# EAGLE schematic Orbit I_AnalougeEngine_V1_0 (EAGLE 8.4.1)

## Sheet 1 of 2: Input Section
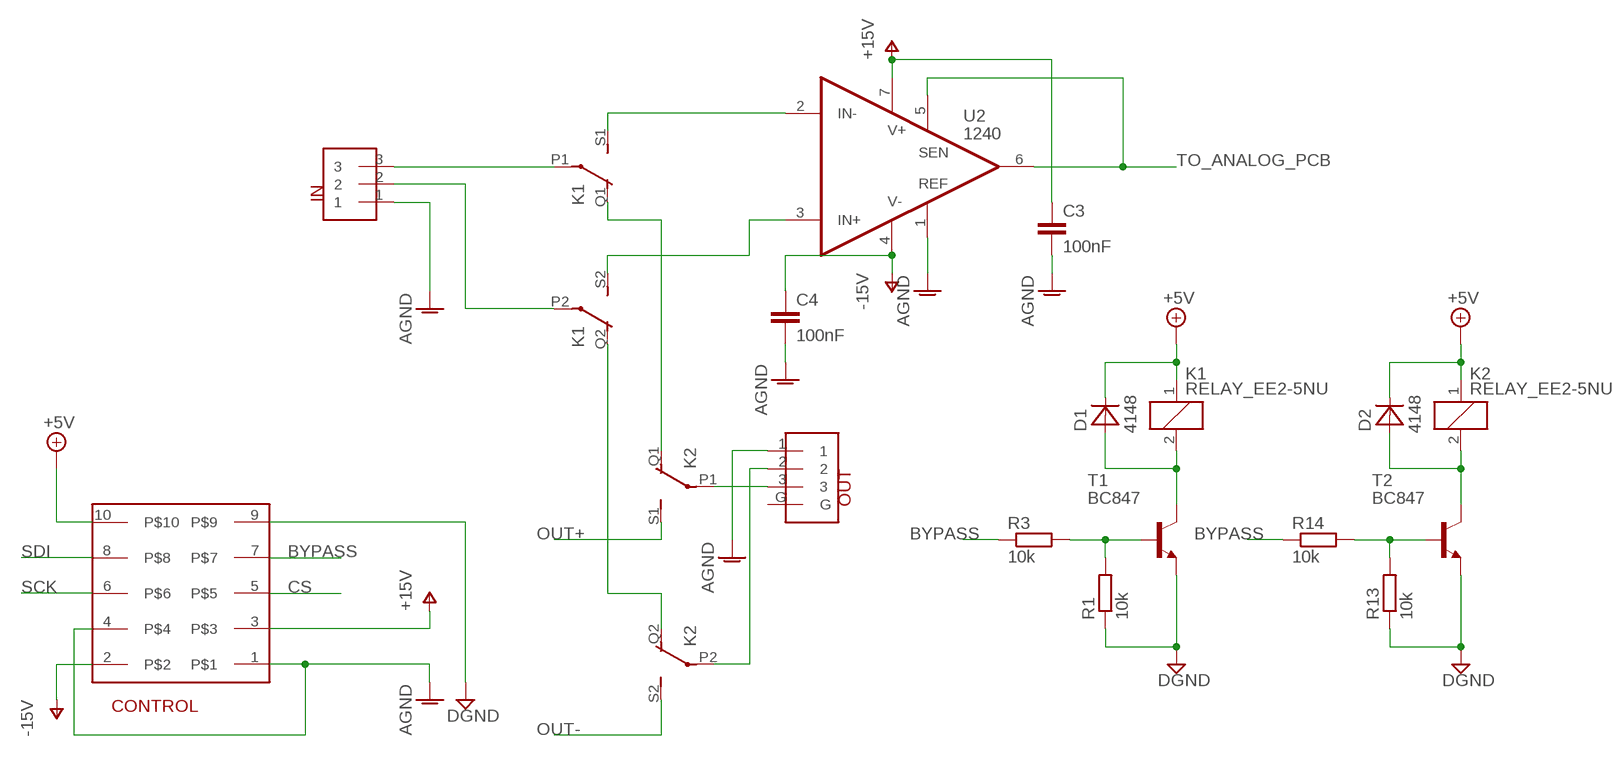
[diagram p0: schematic, sheet 1]

### Parts
C3  100nF  KONDENSATOR_0603  [C0603]
C4  100nF  KONDENSATOR_0603  [C0603]
CONTROL  10PIN_HEADER_SMD  [87832-10]
D1  4148  4148_SOD323  [SOD323-R]
D2  4148  4148_SOD323  [SOD323-R]
IN  NEUTRIK_NC3FAH  [NEUTRIK_NC3FAH]
K1  RELAY_EE2-5NU  [351]
K2  RELAY_EE2-5NU  [351]
OUT  NEUTRIK_NC3MAH  [NEUTRIK_NC3MAH]
R1  10k  WIDERSTAND_0805R0805  [R0805]
R3  10k  WIDERSTAND_0805R0805  [R0805]
R13  10k  WIDERSTAND_0805R0805  [R0805]
R14  10k  WIDERSTAND_0805R0805  [R0805]
T1  BC847  [SOT23]
T2  BC847  [SOT23]
U2  1240  THAT1240SO8-U  [SO08]

### Nets
+5V: CONTROL.10 D1.C D2.C K1.1 K2.1
AGND: C3.2 C4.2 CONTROL.1 CONTROL.4 IN.1 OUT.1 U2.1(REF) ; also sheet 2
BYPASS: CONTROL.7 R3.1 R14.1
CS: CONTROL.5 ; also sheet 2
DGND: CONTROL.9 R1.1 R13.1 T1.2(E) T2.2(E) ; also sheet 2
N$1: K1.S1(2:S) U2.2(IN-)
N$2: K1.S2(3:S) U2.3(IN+)
N$3: D2.A K2.2 T2.3(C)
N$4: R13.2 R14.2 T2.1(B)
N$6: D1.A K1.2 T1.3(C)
N$8: K1.Q1(2:O) K2.Q1(2:O)
N$10: R1.2 R3.2 T1.1(B)
N$11: K1.Q2(3:O) K2.Q2(3:O)
N$21: IN.2 K1.P2(3:P)
N$22: IN.3 K1.P1(2:P)
N$23: K2.P2(3:P) OUT.2
N$24: K2.P1(2:P) OUT.3
OUT+: K2.S1(2:S) ; also sheet 2
OUT-: K2.S2(3:S) ; also sheet 2
SCK: CONTROL.6 ; also sheet 2
SDI: CONTROL.8 ; also sheet 2
TO_ANALOG_PCB: U2.5(SEN) U2.6(OUT) ; also sheet 2
V+: C3.1 CONTROL.3 U2.7(V+) ; supply symbol labelled +15V ; also sheet 2
V-: C4.1 CONTROL.2 U2.4(V-) ; supply symbol labelled -15V ; also sheet 2
Unconnected: OUT.G

## Sheet 2 of 2: Output Section
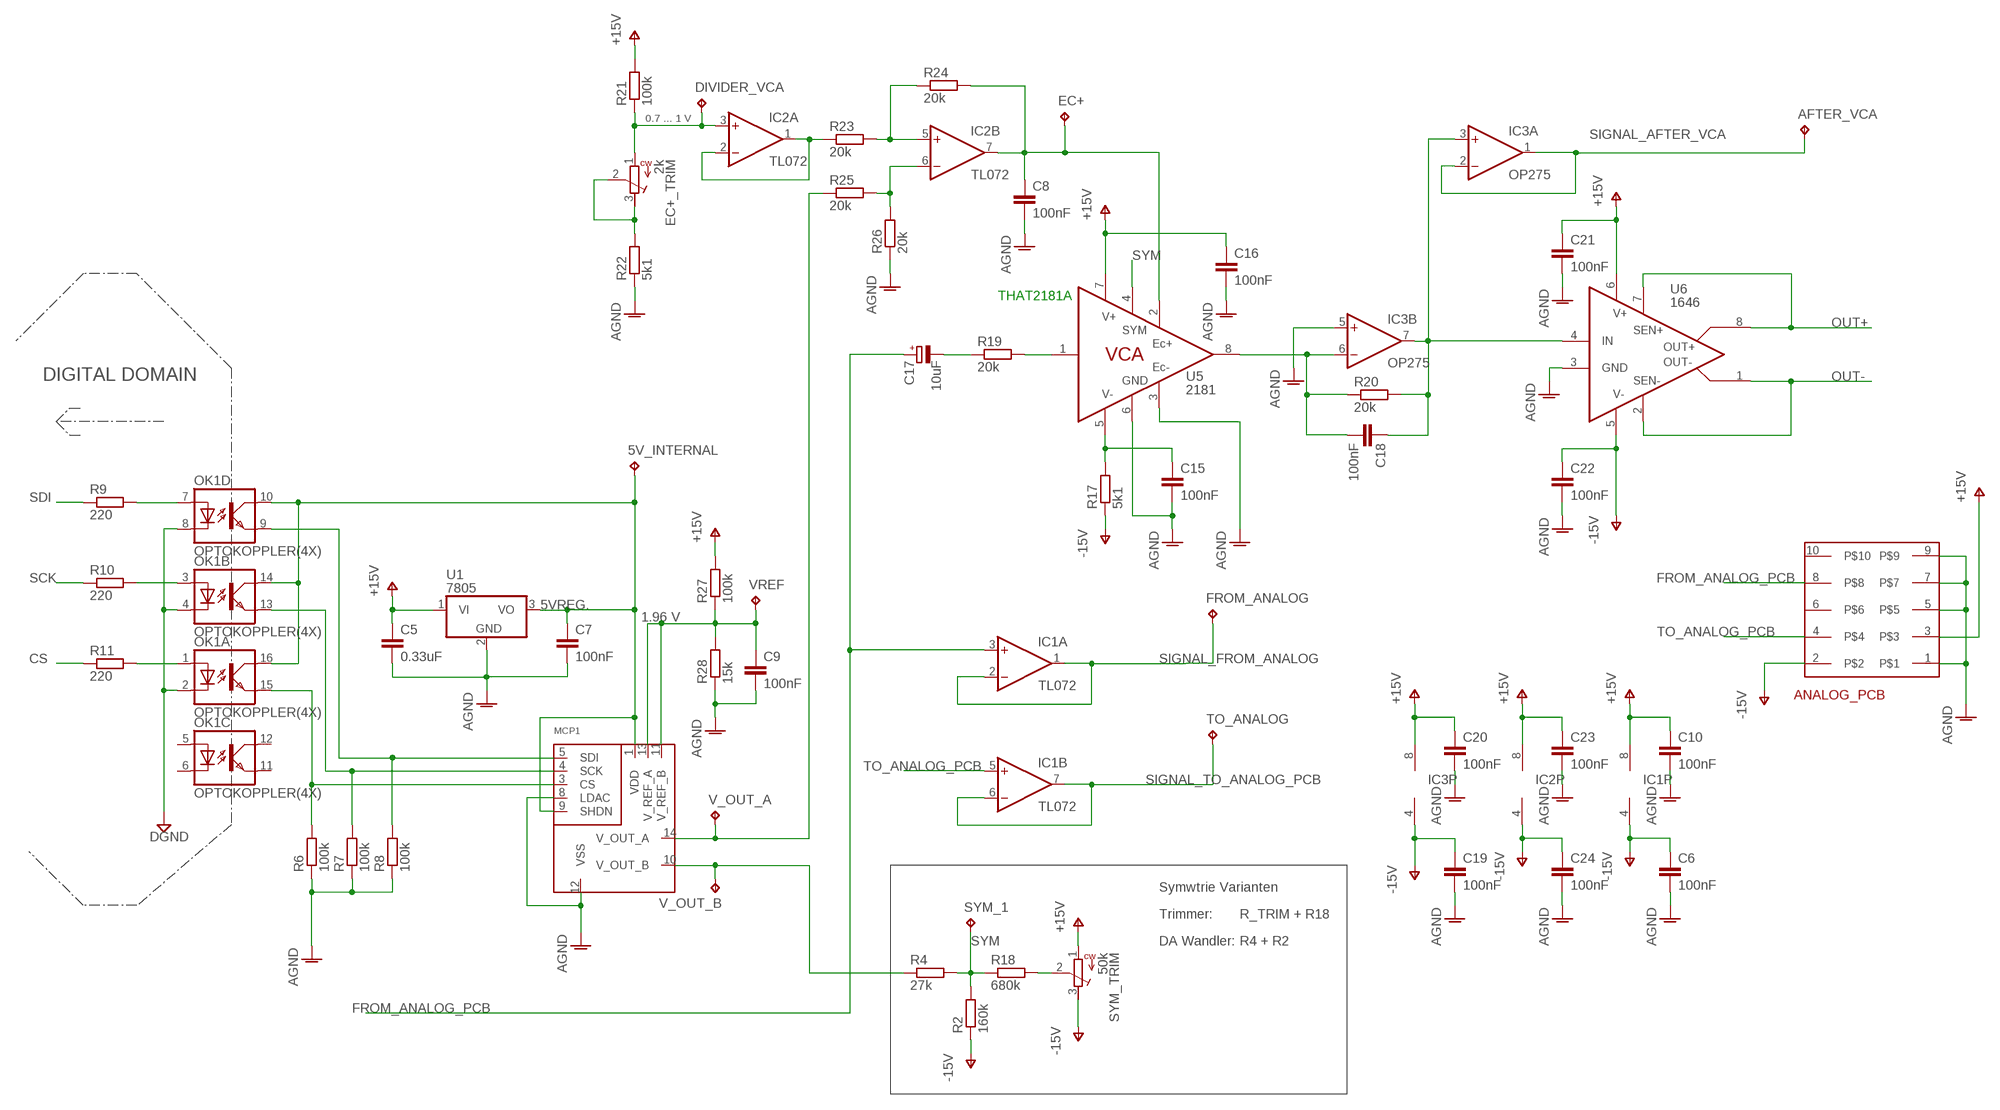
[diagram p1: schematic, sheet 2]

### Parts
5V_INTERNAL  TPTHT  [THT_PIN]
AFTER_VCA  TPTHT  [THT_PIN]
ANALOG_PCB  10PIN_HEADER_SMD  [87832-10]
C5  0.33uF  KONDENSATOR_0603  [C0603]
C6  100nF  KONDENSATOR_0603  [C0603]
C7  100nF  KONDENSATOR_0603  [C0603]
C8  100nF  KONDENSATOR_0603  [C0603]
C9  100nF  KONDENSATOR_0603  [C0603]
C10  100nF  KONDENSATOR_0603  [C0603]
C15  100nF  KONDENSATOR_0603  [C0603]
C16  100nF  KONDENSATOR_0603  [C0603]
C17  10uF  SMD_ELCTROLYTIC  [153CLV-0605]
C18  100nF  KONDENSATOR_0603  [C0603]
C19  100nF  KONDENSATOR_0603  [C0603]
C20  100nF  KONDENSATOR_0603  [C0603]
C21  100nF  KONDENSATOR_0603  [C0603]
C22  100nF  KONDENSATOR_0603  [C0603]
C23  100nF  KONDENSATOR_0603  [C0603]
C24  100nF  KONDENSATOR_0603  [C0603]
DIVIDER_VCA  TPTHT  [THT_PIN]
EC+  TPTHT  [THT_PIN]
EC+_TRIM  2k  R_TRIMMER_SMD  [RTRIM4G/J]
FROM_ANALOG  TPTHT  [THT_PIN]
IC1  TL072  [SOIC8]
IC2  TL072  [SOIC8]
IC3  OP275  [SOIC8]
MCP1  MCP4922  [SOIC16]
OK1  OPTOKOPPLER(4X)  [SOIC16]
R2  160k  WIDERSTAND_0805R0805  [R0805]
R4  27k  WIDERSTAND_0805R0805  [R0805]
R6  100k  WIDERSTAND_0805R0805  [R0805]
R7  100k  WIDERSTAND_0805R0805  [R0805]
R8  100k  WIDERSTAND_0805R0805  [R0805]
R9  220  WIDERSTAND_0805R0805  [R0805]
R10  220  WIDERSTAND_0805R0805  [R0805]
R11  220  WIDERSTAND_0805R0805  [R0805]
R17  5k1  WIDERSTAND_0805R0805  [R0805]
R18  680k  WIDERSTAND_0805R0805  [R0805]
R19  20k  WIDERSTAND_0805R0805  [R0805]
R20  20k  WIDERSTAND_0805R0805  [R0805]
R21  100k  WIDERSTAND_0805R0805  [R0805]
R22  5k1  WIDERSTAND_0805R0805  [R0805]
R23  20k  WIDERSTAND_0805R0805  [R0805]
R24  20k  WIDERSTAND_0805R0805  [R0805]
R25  20k  WIDERSTAND_0805R0805  [R0805]
R26  20k  WIDERSTAND_0805R0805  [R0805]
R27  100k  WIDERSTAND_0805R0805  [R0805]
R28  15k  WIDERSTAND_0805R0805  [R0805]
SYM_1  TPTHT  [THT_PIN]
SYM_TRIM  50k  R_TRIMMER_SMD  [RTRIM4G/J]
TO_ANALOG  TPTHT  [THT_PIN]
U1  7805  78  [TO252]
U5  2181  THAT2181S  [SO08]
U6  1646  THAT1646SO8-U  [SO08]
V_OUT_A  TPTHT  [THT_PIN]
V_OUT_B  TPTHT  [THT_PIN]
VREF  TPTHT  [THT_PIN]

### Nets
5VREG.: 5V_INTERNAL.P$1(TP) C7.1 MCP1.1(VDD) MCP1.9(SHDN) OK1.10(D:COL) OK1.14(B:COL) OK1.16(A:COL) U1.3(VO)
AGND: ANALOG_PCB.1 ANALOG_PCB.5 ANALOG_PCB.7 ANALOG_PCB.9 C5.2 C6.2 C7.2 C8.2 C9.2 C10.2 C15.2 C16.2 C19.2 C20.2 C21.2 C22.2 C23.2 C24.2 IC3.5(B:+IN) MCP1.8(LDAC) MCP1.12(VSS) R6.1 R7.1 R8.1 R22.1 R26.1 R28.1 U1.2(GND) U5.3(EC-) U5.6(GND) U6.3(GND) ; also sheet 1
CS: R11.1 ; also sheet 1
DGND: OK1.2(A:C) OK1.4(B:C) OK1.8(D:C) ; also sheet 1
FROM_ANALOG_PCB: ANALOG_PCB.8 C17.+ IC1.3(A:+IN)
N$5: C17.- R19.1
N$9: MCP1.3(CS) OK1.15(A:EMIT) R6.2
N$12: MCP1.4(SCK) OK1.13(B:EMIT) R7.2
N$13: MCP1.5(SDI) OK1.9(D:EMIT) R8.2
N$15: OK1.7(D:A) R9.2
N$16: OK1.3(B:A) R10.2
N$17: OK1.1(A:A) R11.2
N$19: MCP1.10(V_OUT_B) R4.1 V_OUT_B.P$1(TP)
N$20: R18.2 SYM_TRIM.2
N$26: C15.1 R17.2 U5.5(V-)
N$29: C18.2 IC3.6(B:-IN) R20.1 U5.8(OUT)
N$30: C18.1 IC3.3(A:+IN) IC3.7(B:OUT) R20.2 U6.4(IN)
N$34: R19.2 U5.1(IN)
N$35: DIVIDER_VCA.P$1(TP) EC+_TRIM.1 IC2.3(A:+IN) R21.1
N$36: IC2.1(A:OUT) IC2.2(A:-IN) R23.1
N$37: IC2.5(B:+IN) R23.2 R24.1
N$38: C8.1 EC+.P$1(TP) IC2.7(B:OUT) R24.2 U5.2(EC+)
N$39: IC2.6(B:-IN) R25.2 R26.2
N$40: EC+_TRIM.2 EC+_TRIM.3 R22.2
N$41: MCP1.14(V_OUT_A) R25.1 V_OUT_A.P$1(TP)
N$42: C9.1 MCP1.11(V_REF_B) MCP1.13(V_REF_A) R27.1 R28.2 VREF.P$1(TP)
OUT+: U6.7(SEN+) U6.8(OUT+) ; also sheet 1
OUT-: U6.1(OUT-) U6.2(SEN-) ; also sheet 1
SCK: R10.1 ; also sheet 1
SDI: R9.1 ; also sheet 1
SIGNAL_AFTER_VCA: AFTER_VCA.P$1(TP) IC3.1(A:OUT) IC3.2(A:-IN)
SIGNAL_FROM_ANALOG: FROM_ANALOG.P$1(TP) IC1.1(A:OUT) IC1.2(A:-IN)
SIGNAL_TO_ANALOG_PCB: IC1.6(B:-IN) IC1.7(B:OUT) TO_ANALOG.P$1(TP)
SYM: R2.2 R4.2 R18.1 SYM_1.P$1(TP) U5.4(SYM)
TO_ANALOG_PCB: ANALOG_PCB.4 IC1.5(B:+IN) ; also sheet 1
V+: ANALOG_PCB.3 C5.1 C10.1 C16.1 C20.1 C21.1 C23.1 IC1.8(P:V+) IC2.8(P:V+) IC3.8(P:V+) R21.2 R27.2 SYM_TRIM.1 U1.1(VI) U5.7(V+) U6.6(V+) ; supply symbol labelled +15V ; also sheet 1
V-: ANALOG_PCB.2 C6.1 C19.1 C22.1 C24.1 IC1.4(P:V-) IC2.4(P:V-) IC3.4(P:V-) R2.1 R17.1 SYM_TRIM.3 U6.5(V-) ; supply symbol labelled -15V ; also sheet 1
Unconnected: ANALOG_PCB.6 ANALOG_PCB.10 OK1.5(C:A) OK1.6(C:C) OK1.11(C:EMIT) OK1.12(C:COL)

### Notes on the sheet
- 0.7 ... 1 V
- THAT2181A
- DIGITAL DOMAIN
- 1.96 V
- Symwtrie Varianten
- Trimmer: | R_TRIM + R18
- DA Wandler: | R4 + R2

## Library data of the parts
5V_INTERNAL AFTER_VCA DIVIDER_VCA EC+ FROM_ANALOG SYM_1 TO_ANALOG V_OUT_A V_OUT_B VREF = C_Sager_Bibliothek:TP
ANALOG_PCB CONTROL = C_Sager_Bibliothek:10PIN_HEADER_SMD: 10 Pin Header (Flachbandkabel)
C3-C10 C15 C16 C18-C24 = C_Sager_Bibliothek:KONDENSATOR_0603: Kondensator Standard 0603
C17 = C_Sager_Bibliothek:SMD_ELCTROLYTIC: SMD Elektrolyt Kondensator 153CLV-0605
D1 D2 = C_Sager_Bibliothek:4148_SOD323: Standard 4148 Diode SOD323 Format
EC+_TRIM SYM_TRIM = C_Sager_Bibliothek:R_TRIMMER_SMD
IC1 IC2 = C_Sager_Bibliothek:TL072
IC3 = C_Sager_Bibliothek:OP275: Dual Very Low Noise Precision Operational Amplifier Source: http://www.analog.com/static/imported-files/data_sheets/OP270.pdf
IN = C_Sager_Bibliothek:NEUTRIK_NC3FAH
K1 K2 = C_Sager_Bibliothek:RELAY_EE2-5NU: RELAY SPST; OC_FARNELL: unknown; OC_NEWARK: unknown
MCP1 = SPI:MCP4922: MCP4922 Digital Analog Converter
OK1 = C_Sager_Bibliothek:OPTOKOPPLER(4X): Optokoppler (4x) digikey: TLP291-4(GBE)-ND; OC_FARNELL: unknown; OC_NEWARK: unknown
OUT = C_Sager_Bibliothek:NEUTRIK_NC3MAH
R1-R4 R6-R11 R13 R14 R17-R28 = C_Sager_Bibliothek:WIDERSTAND_0805: RESISTOR, European symbol
T1 T2 = C_Sager_Bibliothek:BC847: NPN TRANSISTOR
U1 = C_Sager_Bibliothek:78**
U2 = THAT_Library:THAT1240: Balanced Line Receiver THAT1240, THAT1243, THAT1246
U5 = THAT_Library:THAT2181: VCA Trimmable IC
U6 = THAT_Library:THAT1646: Outsmarts Balanced Line Driver